# EAGLE design Central Hub (EAGLE 9.3.0)
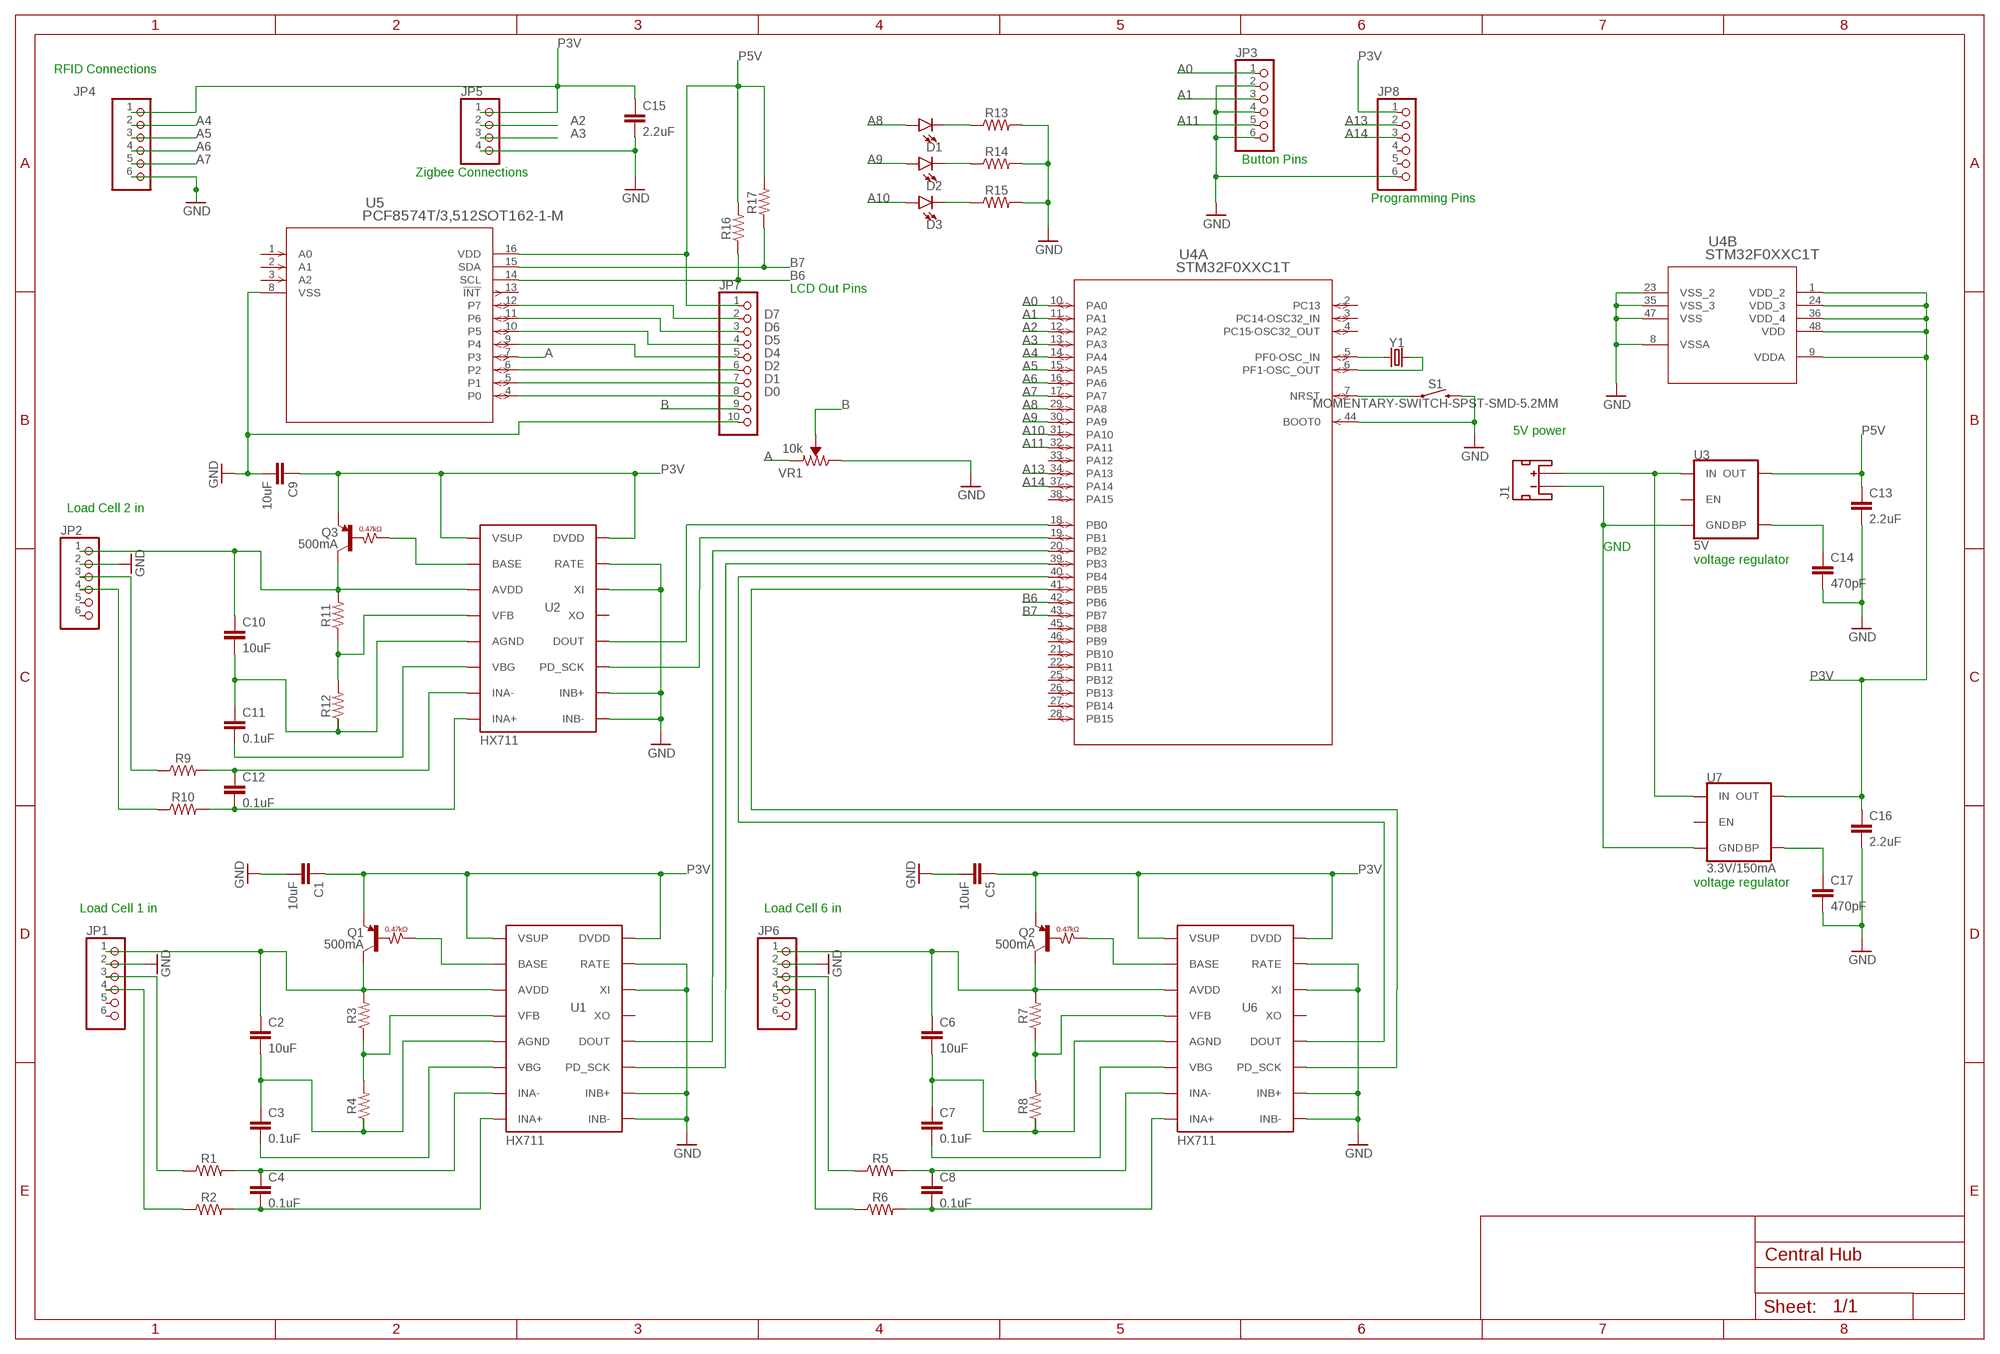
[diagram p0: schematic, sheet 1]

## Parts
C1  10uF  10UF-0603-6.3V-20%  [0603]
C2  10uF  10UF-0603-6.3V-20%  [0603]
C3  0.1uF  0.1UF-0603-25V-(+80/-20%)  [0603]
C4  0.1uF  0.1UF-0603-25V-(+80/-20%)  [0603]
C5  10uF  10UF-0603-6.3V-20%  [0603]
C6  10uF  10UF-0603-6.3V-20%  [0603]
C7  0.1uF  0.1UF-0603-25V-(+80/-20%)  [0603]
C8  0.1uF  0.1UF-0603-25V-(+80/-20%)  [0603]
C9  10uF  10UF-0603-6.3V-20%  [0603]
C10  10uF  10UF-0603-6.3V-20%  [0603]
C11  0.1uF  0.1UF-0603-25V-(+80/-20%)  [0603]
C12  0.1uF  0.1UF-0603-25V-(+80/-20%)  [0603]
C13  2.2uF  2.2UF-0603-10V-20%  [0603]
C14  470pF  470PF-0603-50V-5%  [0603]
C15  2.2uF  2.2UF-0603-10V-20%  [0603]
C16  2.2uF  2.2UF-0603-10V-20%  [0603]
C17  470pF  470PF-0603-50V-5%  [0603]
D1  LED5MM  [LED_5MM]
D2  LED5MM  [LED_5MM]
D3  LED5MM  [LED_5MM]
J1  JST_2MM_MALE  [JST-2-SMD]
JP1  PINHD-1X6  [1X06]
JP2  PINHD-1X6  [1X06]
JP3  PINHD-1X6  [1X06]
JP4  PINHD-1X6  [1X06]
JP5  PINHD-1X4  [1X04]
JP6  PINHD-1X6  [1X06]
JP7  PINHD-1X10  [1X10]
JP8  PINHD-1X6  [1X06]
Q1  500mA  TRANS_PNP_RES-DDTB142TC  [SOT23-3]
Q2  500mA  TRANS_PNP_RES-DDTB142TC  [SOT23-3]
Q3  500mA  TRANS_PNP_RES-DDTB142TC  [SOT23-3]
R1  RESISTOR0603  [0603]
R2  RESISTOR0603  [0603]
R3  RESISTOR0603  [0603]
R4  RESISTOR0603  [0603]
R5  RESISTOR0603  [0603]
R6  RESISTOR0603  [0603]
R7  RESISTOR0603  [0603]
R8  RESISTOR0603  [0603]
R9  RESISTOR0603  [0603]
R10  RESISTOR0603  [0603]
R11  RESISTOR0603  [0603]
R12  RESISTOR0603  [0603]
R13  RESISTOR0603  [0603]
R14  RESISTOR0603  [0603]
R15  RESISTOR0603  [0603]
R16  RESISTOR0603  [0603]
R17  RESISTOR0603  [0603]
S1  MOMENTARY-SWITCH-SPST-SMD-5.2MM  [TACTILE_SWITCH_SMD_5.2MM]
U1  HX711  [SO16]
U2  HX711  [SO16]
U3  5V  V_REG_MIC52055V  [SOT23-5]
U4  STM32F0XXC1T  [LQFP48-7X7MM]
U5  PCF8574T/3,512SOT162-1-M  [SOT162-1-M]
U6  HX711  [SO16]
U7  3.3V/150mA  V_REG_MIC52053.3V  [SOT23-5]
VR1  10k  TRIMPOT-PTH-10MM-KNOB-1/2W-10%  [TRIMPOT-PTH-3386U]
Y1  CRYSTALPTH-HC49US  [HC49US]

## Nets
A: U5.7(P3) VR1.1(CCW)
A0: JP3.1 U4.10(A:PA0)
A1: JP3.3 U4.11(A:PA1)
A2: JP5.2 U4.12(A:PA2)
A3: JP5.3 U4.13(A:PA3)
A4: JP4.2 U4.14(A:PA4)
A5: JP4.3 U4.15(A:PA5)
A6: JP4.4 U4.16(A:PA6)
A7: JP4.5 U4.17(A:PA7)
A8: D1.A U4.29(A:PA8)
A9: D2.A U4.30(A:PA9)
A10: D3.A U4.31(A:PA10)
A11: JP3.5 U4.32(A:PA11)
A13: JP8.2 U4.34(A:PA13)
A14: JP8.3 U4.37(A:PA14)
B: JP7.9 VR1.2(WIPER)
B6: R16.1 U4.42(A:PB6) U5.14(SCL)
B7: R17.1 U4.43(A:PB7) U5.15(SDA)
D0: JP7.8 U5.4(P0)
D1: JP7.7 U5.5(P1)
D2: JP7.6 U5.6(P2)
D4: JP7.5 U5.9(P4)
D5: JP7.4 U5.10(P5)
D6: JP7.3 U5.11(P6)
D7: JP7.2 U5.12(P7)
GND: C1.2 C5.2 C9.2 C13.2 C14.2 C15.2 C16.2 C17.2 JP1.2 JP2.2 JP3.2 JP3.4 JP3.6 JP4.6 JP5.4 JP6.2 JP7.10 JP8.6 R13.2 R14.2 R15.2 S1.3 U1.9(INB-) U1.10(INB+) U1.14(XI) U1.15(RATE) U2.9(INB-) U2.10(INB+) U2.14(XI) U2.15(RATE) U4.8(B:VSSA) U4.23(B:VSS_2) U4.35(B:VSS_3) U4.44(A:BOOT0) U4.47(B:VSS) U5.8(VSS) U6.9(INB-) U6.10(INB+) U6.14(XI) U6.15(RATE) VR1.3(CW)
N$2: JP1.3 R1.1
N$3: JP1.4 R2.1
N$4: C4.1 R1.2 U1.7(INA-)
N$5: C4.2 R2.2 U1.8(INA+)
N$6: Q1.1(B) U1.2(BASE)
N$7: C2.1 JP1.1 Q1.3(C) R3.2 U1.3(AVDD)
N$8: C2.2 C3.1 R4.1 U1.5(AGND)
N$9: R3.1 R4.2 U1.4(VFB)
N$10: S1.1 U4.7(A:NRST)
N$11: C3.2 U1.6(VBG)
N$12: JP6.3 R5.1
N$13: JP6.4 R6.1
N$14: C8.1 R5.2 U6.7(INA-)
N$15: C8.2 R6.2 U6.8(INA+)
N$16: Q2.1(B) U6.2(BASE)
N$17: C6.1 JP6.1 Q2.3(C) R7.2 U6.3(AVDD)
N$18: C6.2 C7.1 R8.1 U6.5(AGND)
N$19: R7.1 R8.2 U6.4(VFB)
N$20: C7.2 U6.6(VBG)
N$21: U4.5(A:PF0-OSC_IN) Y1.1
N$22: U4.6(A:PF1-OSC_OUT) Y1.2
N$23: JP2.3 R9.1
N$24: JP2.4 R10.1
N$25: C12.1 R9.2 U2.7(INA-)
N$26: C12.2 R10.2 U2.8(INA+)
N$27: Q3.1(B) U2.2(BASE)
N$28: C10.1 JP2.1 Q3.3(C) R11.2 U2.3(AVDD)
N$29: C10.2 C11.1 R12.1 U2.5(AGND)
N$30: R11.1 R12.2 U2.4(VFB)
N$31: C11.2 U2.6(VBG)
N$32: J1.1(-) U3.2(GND) U7.2(GND)
N$34: C17.1 U7.4(BP)
N$37: C14.1 U3.4(BP)
N$38: J1.2(+) U3.1(IN) U7.1(IN)
N$39: D1.K(C) R13.1
N$41: D2.K(C) R14.1
N$42: D3.K(C) R15.1
N$54: U4.41(A:PB5) U6.11(PD_SCK)
N$55: U4.40(A:PB4) U6.12(DOUT)
N$56: U1.11(PD_SCK) U4.39(A:PB3)
N$57: U1.12(DOUT) U4.20(A:PB2)
N$58: U2.11(PD_SCK) U4.19(A:PB1)
N$59: U2.12(DOUT) U4.18(A:PB0)
P3V: C1.1 C5.1 C9.1 C15.1 C16.1 JP4.1 JP5.1 JP8.1 Q1.2(E) Q2.2(E) Q3.2(E) U1.1(VSUP) U1.16(DVDD) U2.1(VSUP) U2.16(DVDD) U4.1(B:VDD_2) U4.9(B:VDDA) U4.24(B:VDD_3) U4.36(B:VDD_4) U4.48(B:VDD) U6.1(VSUP) U6.16(DVDD) U7.5(OUT)
P5V: C13.1 JP7.1 R16.2 R17.2 U3.5(OUT) U5.16(VDD)
Unconnected: J1.NC1(PAD1) J1.NC2(PAD2) JP1.5 JP1.6 JP2.5 JP2.6 JP6.5 JP6.6 JP8.4 JP8.5 U1.13(XO) U2.13(XO) U3.3(EN) U4.2(A:PC13) U4.3(A:PC14-OSC32_IN) U4.4(A:PC15-OSC32_OUT) U4.21(A:PB10) U4.22(A:PB11) U4.25(A:PB12) U4.26(A:PB13) U4.27(A:PB14) U4.28(A:PB15) U4.33(A:PA12) U4.38(A:PA15) U4.45(A:PB8) U4.46(A:PB9) U5.1(A0) U5.2(A1) U5.3(A2) U5.13(!INT) U6.13(XO) U7.3(EN)

## Notes on the sheet
- RFID Connections
- Button Pins
- Zigbee Connections
- Programming Pins
- LCD Out Pins
- 5V power
- Load Cell 2 in
- GND
- voltage regulator
- voltage regulator
- Load Cell 1 in | Load Cell 6 in

## Library data of the parts
C1 C2 C5 C6 C9 C10 = SparkFun-Capacitors:10UF: 10.0µF ceramic capacitors A capacitor is a passive two-terminal electrical component used to store electrical energy temporarily in an electric field.; PROD_ID: CAP-11015
C3 C4 C7 C8 C11 C12 = SparkFun-Capacitors:0.1UF: 0.1µF ceramic capacitors A capacitor is a passive two-terminal electrical component used to store electrical energy temporarily in an electric field.; PROD_ID: CAP-00810
C13 C15 C16 = SparkFun-Capacitors:2.2UF: 2.2µF ceramic capacitors A capacitor is a passive two-terminal electrical component used to store electrical energy temporarily in an electric field.; PROD_ID: CAP-07888
C14 C17 = SparkFun-Capacitors:470PF: 470pF ceramic capacitors A capacitor is a passive two-terminal electrical component used to store electrical energy temporarily in an electric field.; PROD_ID: CAP-07884
D1-D3 = SparkFun-LED:LED: LED (Generic) Standard schematic elements and footprints for 5mm, 3mm, 1206, and 0603 sized LEDs. Generic LEDs with no color specified.
J1 = SparkFun-Connectors:JST_2MM_MALE: JST 2MM MALE RA CONNECTOR Two pin, compact surface mount connector. Commonly used as a battery input connection point. We really like the solid locking feeling and high current rating on these small connectors. We use these all the time as battery connectors. Mates to single-cell LiPo batteries. Here is the connector we sell at SparkFun: JST Right Angle Connector - White <https://www.sparkfun.com/products/8612> (PRT-08612) Datasheet <http://www.sparkfun.com/datasheets/Prototyping/Connectors/JST-Horizontal.pdf> It was used on these SparkFun products: SparkFun MOSFET Power Controller <https://www.sparkfun.com/products/11214> (PRT-11214) SparkFun Battery Babysitter - LiPo Battery Manager <https://www.sparkfun.com/products/13777> (PRT-13777) And many, many others that required a lipo battery connection.; PROD_ID: CONN-11443; SF_ID: PRT-08612
JP1-JP4 JP6 JP8 = pinhead:PINHD-1X6: PIN HEADER
JP5 = pinhead:PINHD-1X4: PIN HEADER
JP7 = pinhead:PINHD-1X10: PIN HEADER
Q1-Q3 = SparkFun-DiscreteSemi:TRANS_PNP_RES: PNP transistor with built in base resistor Current controlled device with built in current control for tighter layouts. Link to datasheet <http://www.diodes.com/_files/datasheets/ds30403.pdf>. SparkFun Products: SparkFun OpenSegment Serial Display - White <https://www.sparkfun.com/products/11644> SparkFun OpenSegment Serial Display - Red <https://www.sparkfun.com/products/11644>; PROD_ID: TRANS-11479
R1-R17 = SparkFun-Resistors:RESISTOR: Generic Resistor Package
S1 = SparkFun-Switches:MOMENTARY-SWITCH-SPST: Momentary Switch (Pushbutton) - SPST Normally-open (NO) SPST momentary switches (buttons, pushbuttons). Variants PTH-12MM - 12mm square, through-hole Momentary Pushbutton Switch - 12mm Square <https://www.sparkfun.com/products/9190> (COM-09190) PTH-6.0MM, PTH-6.0MM-KIT - 6.0mm square, through-hole Mini Pushbutton Switch <https://www.sparkfun.com/products/97> (COM-00097) KIT package intended for soldering kit's - only one side of pads' copper is exposed. PTH-RIGHT-ANGLE-KIT - Right-angle, through-hole Right Angle Tactile Button <https://www.sparkfun.com/products/10791> - Used on SparkFun BigTime Watch Kit <https://www.sparkfun.com/products/11734> SMD-12MM - 12mm square, surface-mount Tactile Button - SMD (12mm) <https://www.sparkfun.com/products/12993> (COM-12993) Used on SparkFun PicoBoard <https://www.sparkfun.com/products/11888> SMD-4.5MM - 4.5mm Square Trackball Switch Used on SparkFun Blackberry Trackballer Breakout <https://www.sparkfun.com/products/13169> SMD-4.6MMX2.8MM - 4.60mm x 2.80mm, surface mount Used on SparkFun SAMD21 Mini Breakout <https://www.sparkfun.com/products/13664> SMD-5.2MM, SMD-5.2-REDUNDANT - 5.2mm square, surface-mount Mini Pushbutton Switch - SMD <https://www.sparkfun.com/products/8720> (COM-08720) Used on Arduino Pro Mini <https://www.sparkfun.com/products/11114> REDUNDANT package connects both switch circuits together SMD-6.0X3.5MM - 6.0 x 3.5mm, surface mount Momentary Reset Switch SMD <https://www.sparkfun.com/products/8229> (COM-08229) SMD-6.2MM-TALL - 6.2mm square, surface mount Tactile Button - SMD (6mm) <https://www.sparkfun.com/products/12992> Used on SparkFun Digital Sandbox <https://www.sparkfun.com/products/12651> SMD-RIGHT-ANGLE - Right-angle, surface mount Used on SparkFun Block for Intel® Edison - Arduino <https://www.sparkfun.com/products/13036>; PROD_ID: SWCH-08247; SF_SKU: COM-08720
U1 U2 U6 = SparkFun-IC-Conversion:HX711: AVIA Semiconductor HX711 - ADC 24-Bit Analog-to-Digital Converter for Weigh Scales Datasheet <https://cdn.sparkfun.com/datasheets/Sensors/ForceFlex/hx711_english.pdf> SparkFun Products: SparkFun Load Cell Amplifier - HX711 <https://www.sparkfun.com/products/13879>; PROD_ID: IC-12445
U3 = SparkFun-IC-Power:V_REG_MIC5205: V_REG MIC5205 Standard 3.3V, 5V, and Adjustable 150mA LDO voltage regulator in SOT-23 layout. Micrel part MIC5205. BP (by-pass) pin is used to lower output noise with 470pF cap, may be left open. On the adjustable version BP is used to set output.; PROD_ID: VREG-00823
U4 = ECE477_Resources:STM32F0XXC1T; MANUFACTURER_PART_NUMBER: stm32f0xxc1t; VENDOR: STMicroelectronics
U5 = ECE477_Resources:PCF8574T/3,512; MANUFACTURER_PART_NUMBER: PCF8574T3512; VENDOR: NXP
U7 = SparkFun-IC-Power:V_REG_MIC5205: V_REG MIC5205 Standard 3.3V, 5V, and Adjustable 150mA LDO voltage regulator in SOT-23 layout. Micrel part MIC5205. BP (by-pass) pin is used to lower output noise with 470pF cap, may be left open. On the adjustable version BP is used to set output.; PROD_ID: VREG-00822
VR1 = SparkFun-Resistors:TRIMPOT: Trimming Potentiometer (Trimpot) Three-terminal potentiometers, with an adjustable wiper and two adjustable resistors. A pot can be used to create a configurable voltage divider, or as a variable resistor. "Trimpots" are a subset of potentiometers, usually intended for "set-and-forget" applications. They're often more delicate than standard potentiometers - rated for fewer turns. Variants PTH-KNOB - PTH Trimpot w/ finger-adjustable knob Trimpot 10K with Knob <https://www.sparkfun.com/products/9806> (COM-09806) Datasheet <http://www.sparkfun.com/datasheets/Components/General/TSR-3386.pdf> SMD-3MM-CLOSED-FRAME - SMD 3mm Square Closed-Frame Trimpot Used on e.g. EasyDriver - Stepper Motor Driver <https://www.sparkfun.com/products/12779> Datasheet <http://www.bitechnologies.com/pdfs/22.pdf> (22AR10KTR) SMD-5MM - SMD 5mm Square Closed-Frame Trimpot Used on e.g. IOIO-OTG - V2.2 <https://www.sparkfun.com/products/13613> Datasheet <http://www.vishay.com/docs/51008/ts53.pdf> (TS53YL502MR10) SMD-3MM-1/10W-25% - 3mm Square Open-Frame Trimpot Used on e.g. SparkFun Shapeoko <https://www.sparkfun.com/products/13899> Datasheet <http://www.bourns.com/docs/Product-Datasheets/TC33.pdf> (TC33X-2-103E); PROD_ID: RES-09730; SF_SKU: COM-09806
Y1 = SparkFun-Clocks:CRYSTAL: Crystals (Generic) These are passive quartz crystals, which can be used as a clock source for a microcontroller. Crystal's are two-terminal devices. They require external "load" capacitors to generate an oscillating signal.

## Board
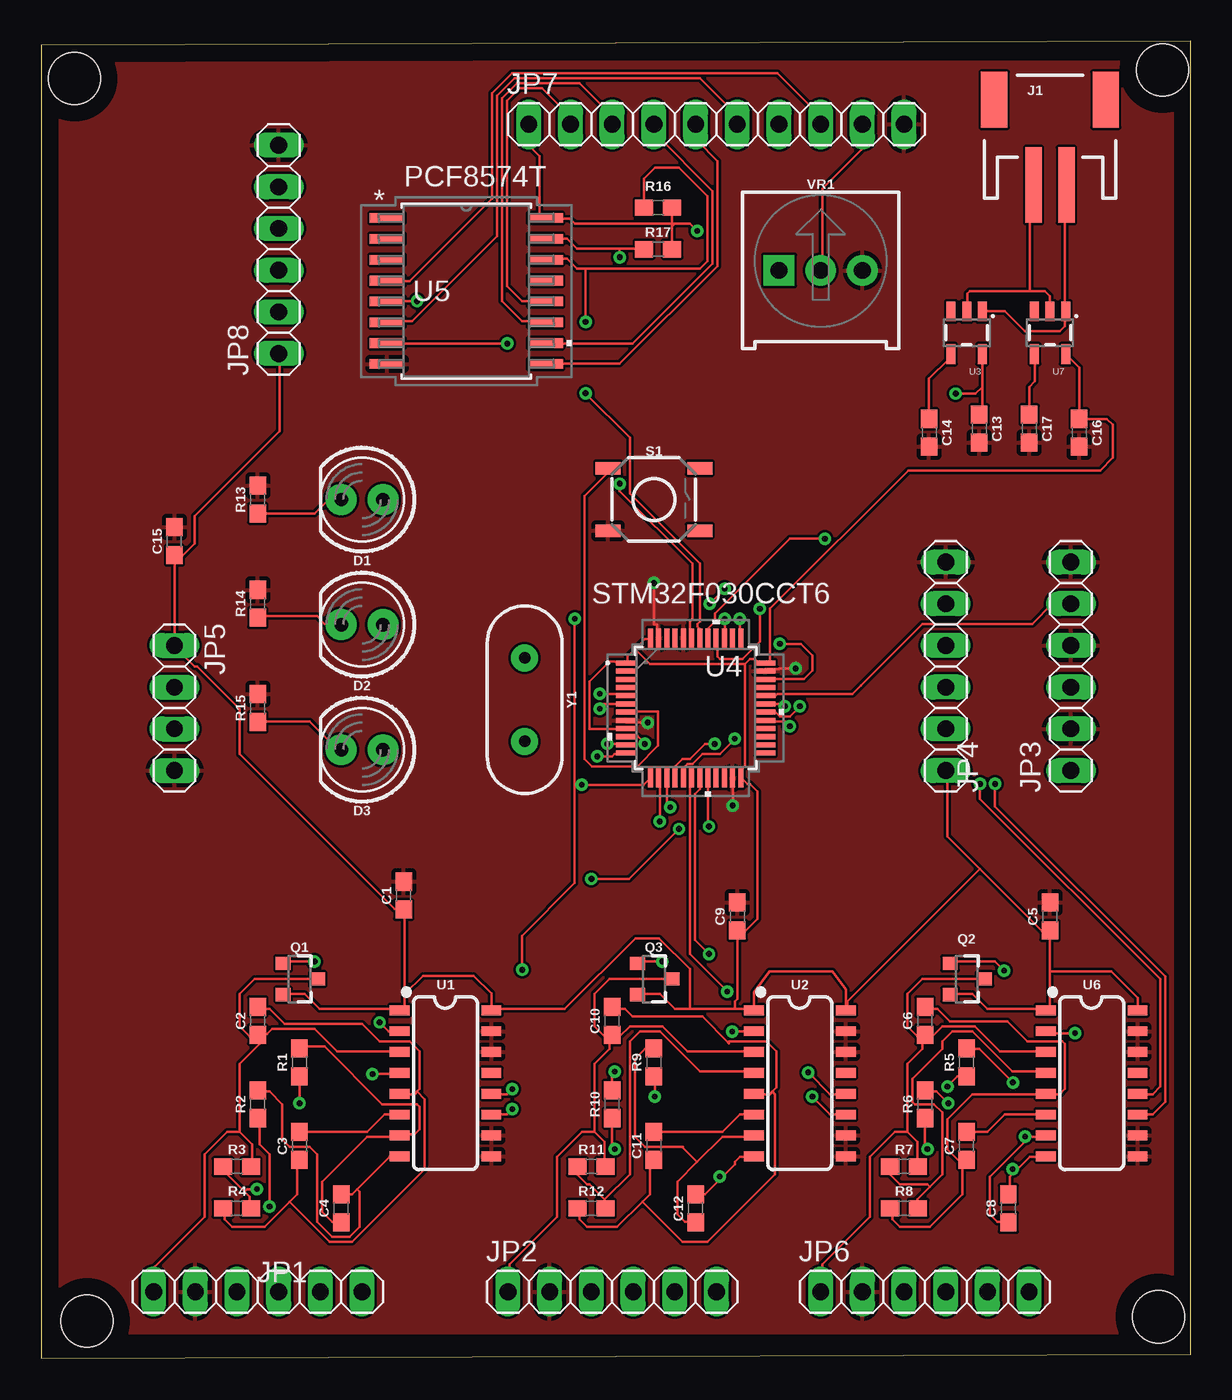
[diagram p1: board, top side]
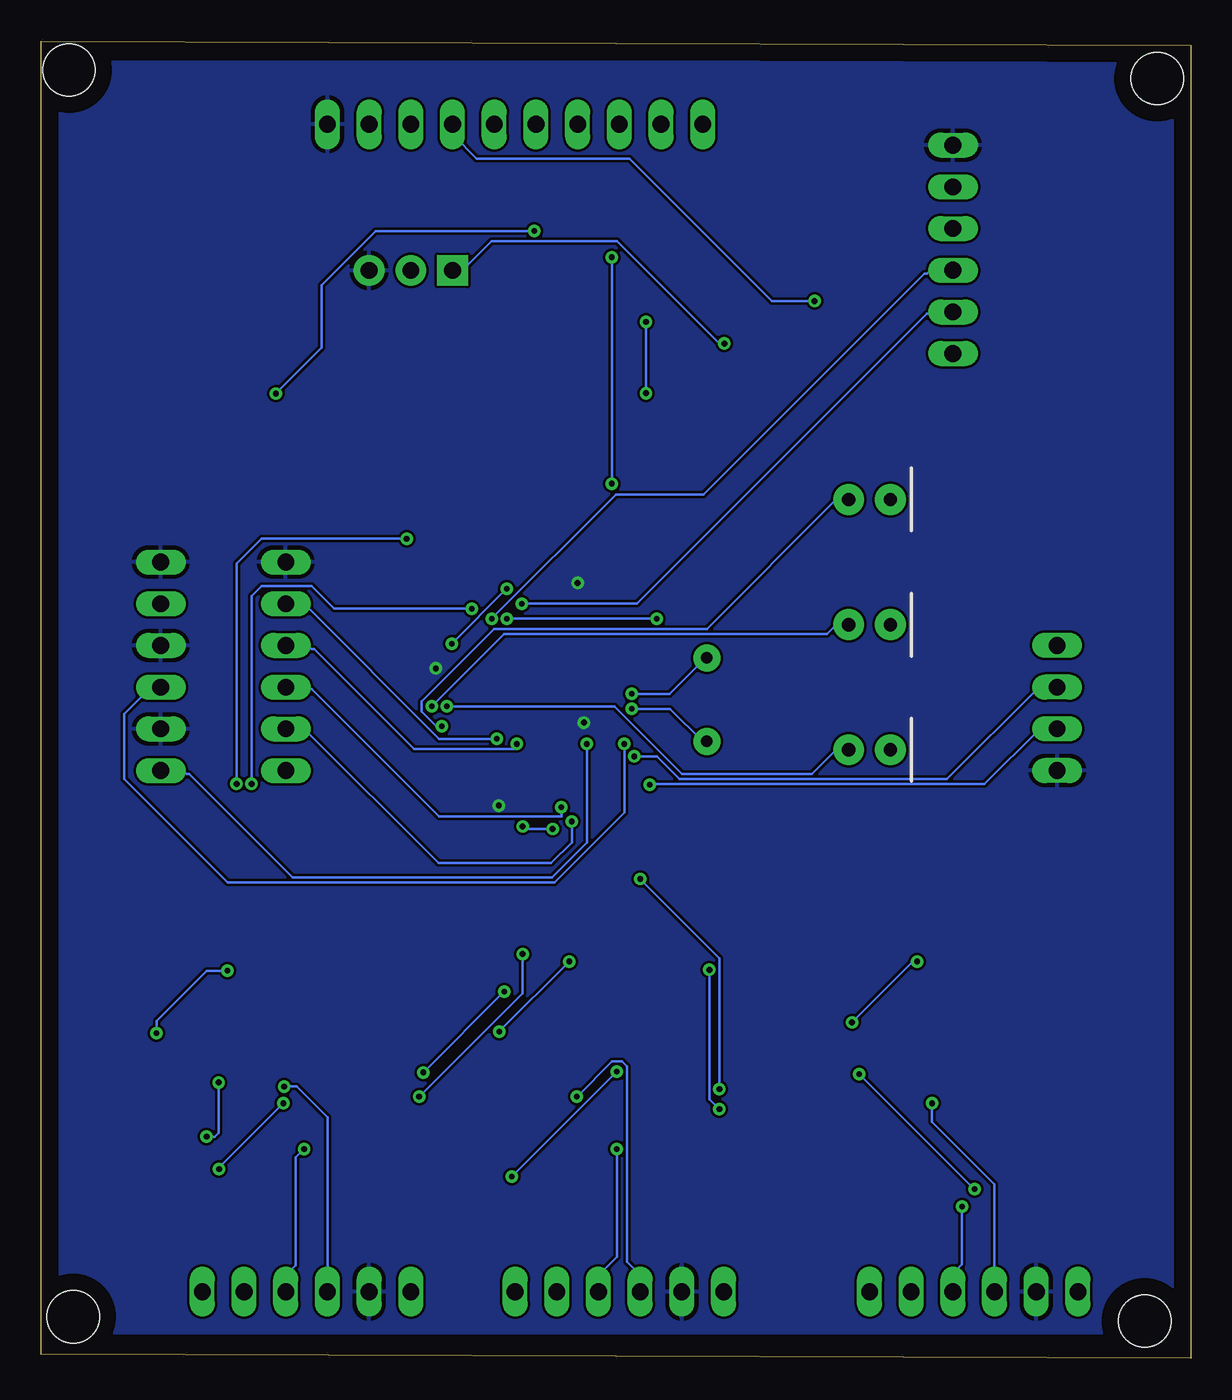
[diagram p2: board, bottom side, seen from below]

Size 70.03 x 80.25 mm. Coordinates in mm from the lower left corner, seen from the top.
Outline: 0,0 70.03,0.25 70.03,80.25 0,80 0,0
Copper layers (1*16): Top 0.035mm / dielectric 1.5mm / Bottom 0.035mm
Design rules "default": minimum track width 6mil, minimum drill 0.35mm, track to track 6mil, track to pad 6mil, pad to pad 6mil, via to via 6mil, smd to smd 6mil, copper to edge 40mil, drill to drill 6mil, minimum pad ring 10mil, minimum via ring 8mil, stop-mask expansion 4mil, vias tented up to drill 0mil, thermal gap 10mil
Holes 3.17 mm at 2.03,77.98 2.79,2.29 68.07,2.54 68.33,78.49

### Footprints (pad centres in the part's own frame; a part is rotated, then mirrored left to right if it is on the bottom)
0603 = smd 1.1 x 1: 1 -0.85,0; 2 0.85,0
LED_5MM = drill 0.813 pad 1.88: A -1.27,0; K 1.27,0
JST-2-SMD = smd 1 x 4.6: 1 -1,-3.7; 2 1,-3.7 | smd 1.6 x 3.4: NC1 -3.4,1.5; NC2 3.4,1.5
1X06 = drill 1.016 long: 1 -6.35,0; 2 -3.81,0; 3 -1.27,0; 4 1.27,0; 5 3.81,0; 6 6.35,0
1X04 = drill 1.016 long: 1 -3.81,0; 2 -1.27,0; 3 1.27,0; 4 3.81,0
1X10 = drill 1.016 long: 1 -11.43,0; 2 -8.89,0; 3 -6.35,0; 4 -3.81,0; 5 -1.27,0; 6 1.27,0; 7 3.81,0; 8 6.35,0; 9 8.89,0; 10 11.43,0
SOT23-3 = smd 0.8 x 0.9: 1 -0.95,-1; 2 0.95,-1; 3 0,1.1
TACTILE_SWITCH_SMD_5.2MM = smd 1.524 x 0.762: 1 -2.794,1.905; 2 2.794,1.905; 3 -2.794,-1.905; 4 2.794,-1.905
SO16 = smd 0.6 x 1.2: 1 -4.445,-2.8; 2 -3.175,-2.8; 3 -1.905,-2.8; 4 -0.635,-2.8; 5 0.635,-2.8; 6 1.905,-2.8; 7 3.175,-2.8; 8 4.445,-2.8; 9 4.445,2.8; 10 3.175,2.8; 11 1.905,2.8; 12 0.635,2.8; 13 -0.635,2.8; 14 -1.905,2.8; 15 -3.175,2.8; 16 -4.445,2.8
SOT23-5 = smd 0.55 x 1.2: 1 -0.95,-1.3; 2 0,-1.3; 3 0.95,-1.3; 4 0.95,1.3; 5 -0.95,1.3
LQFP48-7X7MM = smd 1.194 x 0.305: 1 -4.25,2.75; 2 -4.25,2.25; 3 -4.25,1.75; 4 -4.25,1.25; 5 -4.25,0.75; 6 -4.25,0.25; 7 -4.25,-0.25; 8 -4.25,-0.75; 9 -4.25,-1.25; 10 -4.25,-1.75; 11 -4.25,-2.25; 12 -4.25,-2.75; 25 4.25,-2.75; 26 4.25,-2.25; 27 4.25,-1.75; 28 4.25,-1.25; 29 4.25,-0.75; 30 4.25,-0.25; 31 4.25,0.25; 32 4.25,0.75; 33 4.25,1.25; 34 4.25,1.75; 35 4.25,2.25; 36 4.25,2.75 | smd 0.305 x 1.194: 13 -2.75,-4.25; 14 -2.25,-4.25; 15 -1.75,-4.25; 16 -1.25,-4.25; 17 -0.75,-4.25; 18 -0.25,-4.25; 19 0.25,-4.25; 20 0.75,-4.25; 21 1.25,-4.25; 22 1.75,-4.25; 23 2.25,-4.25; 24 2.75,-4.25; 37 2.75,4.25; 38 2.25,4.25; 39 1.75,4.25; 40 1.25,4.25; 41 0.75,4.25; 42 0.25,4.25; 43 -0.25,4.25; 44 -0.75,4.25; 45 -1.25,4.25; 46 -1.75,4.25; 47 -2.25,4.25; 48 -2.75,4.25
SOT162-1-M = smd 2.108 x 0.584: 1 -4.826,4.445; 2 -4.826,3.175; 3 -4.826,1.905; 4 -4.826,0.635; 5 -4.826,-0.635; 6 -4.826,-1.905; 7 -4.826,-3.175; 8 -4.826,-4.445; 9 4.826,-4.445; 10 4.826,-3.175; 11 4.826,-1.905; 12 4.826,-0.635; 13 4.826,0.635; 14 4.826,1.905; 15 4.826,3.175; 16 4.826,4.445
TRIMPOT-PTH-3386U = drill 1.016 pad 1.88 square: 1 -2.54,-0.015 | drill 1.016 pad 1.88: 2 0,-0.015; 3 2.54,-0.015
HC49US = drill 0.7 pad 1.651: 1 -2.54,0; 2 2.54,0

### Placement (x,y rotation side)
C1  22.1,28.19 90 top
C2  13.21,20.57 90 top
C3  15.75,12.95 90 top
C4  18.29,9.14 90 top
C5  61.47,26.92 90 top
C6  53.85,20.57 90 top
C7  56.39,12.95 90 top
C8  58.93,9.14 90 top
C9  42.42,26.92 90 top
C10  34.8,20.57 90 top
C11  37.34,12.95 90 top
C12  39.88,9.14 90 top
C13  57.15,56.64 270 top
C14  54.1,56.39 270 top
C15  8.13,49.78 90 top
C16  63.25,56.39 270 top
C17  60.2,56.64 270 top
D1  19.56,52.32 180 top
D2  19.56,44.7 180 top
D3  19.56,37.08 180 top
J1  61.47,75.18 0 top
JP1  13.21,4.06 0 top
JP2  34.8,4.06 0 top
JP3  62.74,42.16 90 top
JP4  55.12,42.16 90 top
JP5  8.13,39.62 270 top
JP6  53.85,4.06 0 top
JP7  41.15,75.18 0 top
JP8  14.48,67.56 90 top
Q1  15.75,23.11 270 top
Q2  56.39,23.11 270 top
Q3  37.34,23.11 270 top
R1  15.75,18.03 90 top
R2  13.21,15.49 90 top
R3  11.94,11.68 0 top
R4  11.94,9.14 0 top
R5  56.39,18.03 90 top
R6  53.85,15.49 90 top
R7  52.58,11.68 0 top
R8  52.58,9.14 0 top
R9  37.34,18.03 90 top
R10  34.8,15.49 90 top
R11  33.53,11.68 0 top
R12  33.53,9.14 0 top
R13  13.21,52.32 90 top
R14  13.21,45.97 90 top
R15  13.21,39.62 90 top
R16  37.59,70.1 0 top
R17  37.59,67.56 0 top
S1  37.34,52.32 0 top
U1  24.64,16.76 270 top
U2  46.23,16.76 270 top
U3  56.39,62.48 180 top
U4  39.88,39.62 0 top
U5  25.91,65.02 0 top
U6  64.01,16.76 270 top
U7  61.47,62.48 180 top
VR1  47.5,66.29 0 top
Y1  29.46,40.13 270 top

### Tracks (layer width: path | path; a pad name or v marks a point on that pad's centre or on a via)
A  (via drill 0.35)
  Top 0.152: v28.4,61.82 21.08,61.82 U5.7
  Bottom 0.152: v28.4,61.82 28.7,61.82 34.95,68.07 42.57,68.07 44.25,66.4 44.86,66.4 VR1.1
A0  (via drill 0.35)
  Top 0.152: v36.78,37.44 36.78,37.46 36.34,37.91 36.32,37.9 35.71,37.9 U4.10
  Bottom 0.152: v36.78,37.44 36.78,31.45 38.91,29.31 54.71,29.31 61.01,35.61 61.16,35.61 61.32,35.76 62.69,35.76 JP3.1
A1  (via drill 0.35)
  Top 0.152: v34.49,37.44 35.56,37.44 U4.11
  Bottom 0.152: v34.49,37.44 34.49,33.27 38.76,29.01 58.67,29.01 64.97,35.31 64.97,39.27 63.45,40.79 62.84,40.79 JP3.3
A2  (via drill 0.35)
  Top 0.152: v33.88,36.68 34.8,36.68 34.95,36.83 35.56,36.83 U4.12
  Bottom 0.152: v33.88,36.68 32.51,36.68 31.14,35.31 14.83,35.31 9.35,40.79 8.13,40.79 JP5.2
A3  (via drill 0.35)
  Top 0.152: U4.13 36.7,34.95 v32.94,34.95
  Bottom 0.152: v32.94,34.95 32.89,35 12.55,35 9.2,38.35 JP5.3
A4  (via drill 0.35)
  Top 0.152: U4.14 37.69,35.31 v37.69,32.71
  Bottom 0.152: v37.69,32.71 37.69,31.45 38.96,30.18 45.82,30.18 54,38.35 JP4.2
A5  (via drill 0.35)
  Top 0.152: U4.15 38.13,33.78 v38.33,33.58
  Bottom 0.152: v38.33,33.58 38.33,33.02 45.77,33.02 53.54,40.79 55.07,40.79 JP4.3
A6  (via drill 0.35)
  Top 0.152: v41.05,37.44 40.44,37.44 39.52,36.52 39.07,36.52 38.61,36.07 38.61,35.46 U4.16
  Bottom 0.152: v41.05,37.44 41.05,37.13 47.29,37.13 53.39,43.23 53.54,43.23 53.7,43.38 55.07,43.38 JP4.4
A7  (via drill 0.35)
  Top 0.152: v42.27,37.74 41.35,36.83 40.28,36.83 39.68,36.22 39.37,36.22 39.22,36.07 39.22,35.46 U4.17
  Bottom 0.152: v42.27,37.74 45.77,37.74 54,45.97 JP4.5
A8  (via drill 0.35)
  Top 0.152: v45.62,38.51 45.31,38.81 44.25,38.81 U4.29
  Bottom 0.152: v45.62,38.51 45.92,38.51 46.84,39.42 46.84,40.03 42.42,44.45 29.46,44.45 21.69,52.22 20.93,52.22 D1.A
A9  (via drill 0.35)
  Top 0.152: v46.23,39.73 45.62,39.12 45.01,39.12 44.7,39.42 44.25,39.42 U4.30
  Bottom 0.152: v46.23,39.73 41.81,44.14 22.15,44.14 21.69,44.6 20.93,44.6 D2.A
A10  (via drill 0.35)
  Top 0.152: 44.25,39.88 U4.31 45.16,39.87 v45.31,39.73
  Bottom 0.152: v45.31,39.73 35.1,39.73 30.99,35.61 23.06,35.61 21.69,36.98 20.93,36.98 D3.A
A11
  Top 0.152: JP3.5 61.62,45.97 60.4,44.75 53.7,44.75 49.94,41 49.43,40.49 44.86,40.49 44.7,40.34 44.25,40.34 U4.32
A13  (via drill 0.35)
  Top 0.152: v45.01,43.54 46.28,43.54 46.99,42.82 46.99,41.91 46.48,41.4 44.16,41.4 U4.34 44.25,41.4 | v40.74,45.97 v41.66,46.89
  Bottom 0.152: v41.66,46.89 v45.01,43.54 | v40.74,45.97 33.73,45.97 16.05,63.65 14.53,63.65 JP8.2
A14  (via drill 0.35)
  Top 0.152: v42.57,45.06 42.57,43.99 U4.37
  Bottom 0.152: v42.57,45.06 35,52.63 29.67,52.63 16.2,66.09 16.05,66.09 15.9,66.24 14.53,66.24 JP8.3
B
  Top 0.152: JP7.9 50.04,73.71 47.6,71.27 47.6,66.4 VR1.2
B6  (via drill 0.35)
  Top 0.152: 33.17,66.4 32.66,66.4 32.05,67.01 30.84,67.01 U5.14 | 33.17,66.4 40.13,66.4 40.59,66.85 40.59,70.82 38.86,72.54 37.4,72.54 36.74,71.88 R16.1 | 33.17,66.4 v33.17,63.14 | v33.17,58.8 33.17,58.78 35.87,56.08 35.87,52.68 40.13,48.41 40.13,44.91 39.98,44.75 39.98,44.6 40.13,44.45 40.13,43.99 U4.42
  Bottom 0.152: v33.17,63.14 v33.17,58.8
B7  (via drill 0.35)
  Top 0.152: 35.26,67.62 32.66,67.62 32.05,68.22 30.84,68.22 U5.15 | 35.26,67.62 36.68,67.62 R17.1 | v35.26,53.29 35.26,52.83 39.68,48.41 39.68,45.06 39.52,44.91 39.52,43.99 U4.43 | 35.26,67.62 v35.26,67.08
  Bottom 0.152: v35.26,67.08 v35.26,53.29
D0
  Top 0.152: U5.4 21.08,65.63 22.45,65.63 27.48,70.66 27.48,77.06 28.7,78.28 44.86,78.28 47.45,75.69 47.45,75.23 JP7.8
D1  (via drill 0.35)
  Top 0.152: v22.91,64.41 21.08,64.41 U5.5
  Bottom 0.152: v22.91,64.41 25.5,64.41 34.19,73.1 43.48,73.1 44.86,74.47 44.86,75.08 JP7.7
D2
  Top 0.152: JP7.6 42.42,75.69 40.13,77.98 28.85,77.98 27.79,76.91 27.79,68.38 22.61,63.2 21.08,63.2 U5.6
D4
  Top 0.152: U5.9 30.84,60.6 35.26,60.6 41.2,66.55 41.2,72.95 39.98,74.17 39.98,75.08 JP7.5
D5
  Top 0.152: U5.10 30.84,61.82 36.02,61.82 40.89,66.7 40.89,71.12 37.39,74.62 37.39,75.08 JP7.4
D6
  Top 0.152: JP7.3 34.8,75.69 32.82,77.67 29.01,77.67 28.09,76.76 28.09,64.41 29.31,63.2 30.68,63.2 U5.11
D7
  Top 0.152: U5.12 30.68,64.41 29.31,64.41 28.4,65.33 28.4,76.61 29.16,77.37 30.53,77.37 32.21,75.69 32.21,75.23 JP7.2
GND  (via drill 0.35)
  Top 0.152: U4.8 35.63,38.75 36.45,38.75 36.45,38.73 v36.96,38.73 | U4.47 37.51,43.87 37.51,44.7 37.34,44.7 v37.34,47.24 | v45.97,42.04 44.95,42.04 44.95,41.99 44.13,41.99 U4.35 | U4.23 arc-90 42.14,35.36 v42.14,33.68
  pour Top: 1.02,1.52 1.02,78.99 69.09,78.99 69.09,1.52
  pour Bottom: 1.02,1.52 1.02,78.99 69.09,78.99 69.09,1.52
N$2  (via drill 0.35)
  Top 0.152: v15.75,15.54 R1.1
  Bottom 0.152: v15.75,15.54 15.75,14.43 11.94,10.62 JP1.3
N$3  (via drill 0.35)
  Top 0.152: v13.92,9.25 13.92,12.45 13.31,13.06 13.31,14.58 R2.1
  Bottom 0.152: v13.92,9.25 13.92,5.74 14.38,5.28 14.38,4.06 JP1.4
N$4
  Top 0.152: C4.1 18.19,8.33 17.73,8.33 17.12,8.94 17.12,10.77 19.86,13.51 21.69,13.51 U1.7 21.84,13.66 22.76,13.66 23.06,13.97 23.06,15.34 22.91,15.49 22.45,15.49 22.1,15.49 20.78,15.49 17.27,19 15.75,19 R1.2
N$5
  Top 0.152: 19.25,10.31 18.95,10.01 18.34,10.01 C4.2 | 19.25,10.31 21.23,12.29 21.69,12.29 U1.8 | 19.25,10.31 19.41,10.16 19.41,8.03 18.8,7.42 17.73,7.42 16.81,8.33 16.81,12.45 16.36,12.9 15.14,12.9 14.68,13.36 14.68,15.49 13.92,16.26 13.31,16.26 R2.2
N$6  (via drill 0.35)
  Top 0.152: v16.66,24.18 14.83,24.18 Q1.1 | v20.62,20.47 21.18,19.91 21.69,19.91 U1.2
  Bottom 0.152: v20.62,20.47 16.92,24.18 v16.66,24.18
N$7
  Top 0.152: Q1.3 13,23.11 12.09,22.2 12.09,20.22 12.7,19.61 13.16,19.61 C2.1 | 12.09,13.82 12.85,13.06 12.85,11.68 R3.2 | 12.09,13.82 12.09,17.93 13.31,19.15 13.31,19.61 C2.1 | U1.3 21.69,18.69 18.03,18.69 16.66,20.07 14.07,20.07 13.77,19.76 13.31,19.76 C2.1 | 12.09,13.82 11.33,13.82 9.96,12.45 9.96,8.64 6.91,5.59 6.91,4.06 JP1.1
N$8
  Top 0.152: 15.14,9.55 15.6,10.01 15.6,11.84 15.75,11.99 C3.1 | 15.14,9.55 13.61,8.03 11.63,8.03 11.18,8.48 11.18,9.09 R4.1 | 22.91,16.26 22.76,16.1 21.84,16.1 U1.5 | 22.91,16.26 23.06,16.41 23.06,18.69 22.45,19.3 20.62,19.3 19.56,20.37 14.83,20.37 13.92,21.29 13.31,21.29 C2.2 | 15.14,9.55 17.58,7.11 18.95,7.11 23.37,11.53 23.37,15.8 22.91,16.26
N$9  (via drill 0.35)
  Top 0.152: 12.39,10.16 11.15,11.4 11.15,11.62 R3.1 | 12.39,10.16 12.7,9.86 12.7,9.25 R4.2 | v20.19,17.32 21.69,17.32 U1.4 | v13.16,10.31 12.55,10.31 12.39,10.16
  Bottom 0.152: v20.19,17.32 20.19,17.35 v13.16,10.31
N$10
  Top 0.152: U4.7 35.71,39.42 37.59,39.42 37.59,37.34 36.32,36.07 33.58,36.07 33.12,36.52 33.12,52.53 34.49,53.9 34.49,54.2 S1.1
N$11
  Top 0.152: C3.2 15.75,13.82 19.86,13.82 20.93,14.88 21.69,14.88 U1.6
N$12  (via drill 0.35)
  Top 0.152: v55.22,16.56 55.83,17.17 56.29,17.17 R5.1
  Bottom 0.152: v55.22,16.56 54.46,16.56 52.58,14.68 JP6.3
N$13  (via drill 0.35)
  Top 0.152: R6.1 53.85,12.9 v54,12.75
  Bottom 0.152: v54,12.75 54.51,12.24 54.51,5.69 55.07,5.13 55.07,4.06 JP6.4
N$14  (via drill 0.35)
  Top 0.152: 60.1,13.36 60.25,13.51 61.16,13.51 U6.7 | 60.1,13.36 57.81,11.07 57.81,8.79 58.27,8.33 58.88,8.33 C8.1 | v59.21,16.82 57.18,18.85 56.44,18.85 R5.2 | 60.1,13.36 v59.94,13.51
  Bottom 0.152: v59.21,16.82 59.21,13.74 59.44,13.51 v59.94,13.51
N$15  (via drill 0.35)
  Top 0.152: 59.33,11.38 60.25,12.29 61.16,12.29 U6.8 | 59.33,11.38 59.03,11.07 59.03,10.01 C8.2 | v55.27,15.54 54.56,16.26 53.85,16.26 R6.2 | 59.33,11.38 v59.18,11.53
  Bottom 0.152: v59.18,11.53 59.18,11.63 v55.27,15.54
N$16  (via drill 0.35)
  Top 0.152: Q2.1 55.52,24.18 58.12,24.18 v58.67,23.62 | 61.16,19.91 U6.2 61.34,19.81 v62.99,19.81
  Bottom 0.152: v62.99,19.81 62.99,20.57 59.94,23.62 v58.67,23.62
N$17
  Top 0.152: Q2.3 53.7,23.11 52.78,22.2 52.78,20.22 53.39,19.61 53.7,19.61 | 53.85,19.61 53.7,19.61 | 52.78,13.82 53.39,13.21 53.39,11.68 R7.2 | 52.78,13.82 52.78,17.93 53.7,18.85 53.7,19.61 | 53.7,19.61 C6.1 53.85,19.61 | 53.85,19.61 54.3,19.61 54.91,20.22 56.9,20.22 58.42,18.69 61.16,18.69 U6.3 | 52.78,13.82 52.02,13.82 50.49,12.29 50.49,8.64 47.6,5.74 47.6,4.06 JP6.1
N$18
  Top 0.152: C7.1 56.13,11.85 56.13,10.01 54.15,8.03 52.32,8.03 51.87,8.48 51.87,9.09 R8.1 | 56.13,11.84 56.29,11.99 C7.1 | C6.2 53.85,21.29 54.61,21.29 55.37,20.52 58.88,20.52 60.1,19.3 62.18,19.3 62.21,19.33 62.38,19.15 62.38,16.41 62.08,16.1 61.32,16.1 U6.5 61.16,16.1 56.74,16.1 55.22,14.58 55.22,12.75 56.13,11.84 | 56.13,11.84 C7.1
N$19
  Top 0.152: 54.15,10.46 54,10.62 52.32,10.62 51.71,11.23 51.71,11.68 R7.1 | R8.2 53.39,9.25 53.39,9.7 54.15,10.46 | 54.15,10.46 54.91,11.23 54.91,14.99 54.41,15.49 53.24,15.49 53.09,15.65 53.09,17.02 54.91,18.85 54.91,19.3 55.52,19.91 56.74,19.91 59.18,17.48 61.16,17.48 U6.4
N$20
  Top 0.152: C7.2 56.44,13.82 57.66,13.82 58.73,14.88 61.16,14.88 U6.6
N$21  (via drill 0.35)
  Top 0.152: v34.04,40.49 35.56,40.49 U4.5
  Bottom 0.152: v34.04,40.49 31.75,40.49 29.57,42.67 Y1.1
N$22  (via drill 0.35)
  Top 0.152: v34.04,39.57 34.04,39.65 34.26,39.88 35.56,39.88 U4.6
  Bottom 0.152: v34.04,39.57 31.7,39.57 29.72,37.59 Y1.2
N$23  (via drill 0.35)
  Top 0.152: v37.39,15.95 37.39,17.17 R9.1
  Bottom 0.152: v37.39,15.95 35.26,18.09 34.65,18.09 34.34,17.78 34.34,5.89 33.58,5.13 33.58,4.06 JP2.3
N$24  (via drill 0.35)
  Top 0.152: R10.1 34.8,12.9 v34.95,12.75
  Bottom 0.152: v34.95,12.75 34.95,6.2 36.02,5.13 36.02,4.06 JP2.4
N$25
  Top 0.152: 39.95,11.96 41.5,13.51 43.33,13.51 U2.7 | 39.95,11.96 38.76,10.77 38.76,8.79 39.22,8.33 39.83,8.33 C12.1 | 39.95,11.96 39.07,12.85 39.12,12.9 36.78,12.9 36.17,13.51 36.17,18.24 36.78,18.85 37.24,18.85 R9.2
N$26  (via drill 0.35)
  Top 0.152: 41.5,11.07 42.27,11.84 42.27,11.99 42.57,12.29 43.33,12.29 U2.8 | 41.5,11.07 40.44,10.01 39.98,10.01 C12.2 | R10.2 34.8,17.32 v34.95,17.48 | 41.5,11.07 v41.35,11.07
  Bottom 0.152: v41.35,11.07 v34.95,17.48
N$27  (via drill 0.35)
  Top 0.152: v37.85,24.18 36.47,24.18 Q3.1 | v42.11,19.91 43.33,19.91 U2.2
  Bottom 0.152: v42.11,19.91 v37.85,24.18
N$28
  Top 0.152: Q3.3 34.65,23.11 33.73,22.2 33.73,20.22 34.34,19.61 34.65,19.61 | 34.8,19.61 34.65,19.61 | 33.73,13.82 34.34,13.21 34.34,11.68 R11.2 | 33.73,13.82 33.73,17.93 34.65,18.85 34.65,19.61 | 34.65,19.61 C10.1 34.8,19.61 | 34.8,19.61 35.26,19.61 35.87,20.22 37.85,20.22 39.37,18.69 43.33,18.69 U2.3 | 33.73,13.82 32.97,13.82 31.45,12.29 31.45,8.64 28.55,5.74 28.55,4.06 JP2.1
N$29
  Top 0.152: 36.63,9.55 37.08,10.01 37.08,11.84 37.24,11.99 C11.1 | 36.63,9.55 35.1,8.03 33.27,8.03 32.82,8.48 32.82,9.09 R12.1 | 41.91,19.2 41.86,19.25 | 41.86,19.25 40.28,20.83 36.02,20.83 35.56,21.29 34.8,21.29 C10.2 | 44.55,16.26 44.4,16.1 43.48,16.1 U2.5 | 44.55,16.26 44.81,16.51 44.81,18.69 44.2,19.3 41.91,19.3 41.86,19.25 | 36.63,9.55 39.07,7.11 40.59,7.11 44.7,11.23 44.7,16.1 44.55,16.26
N$30
  Top 0.152: 34.34,9.7 34.34,9.25 R12.2 | 34.34,9.7 33.43,10.62 33.27,10.62 32.66,11.23 32.66,11.68 R11.1 | 34.34,9.7 35.87,11.23 35.87,19.3 36.47,19.91 37.69,19.91 40.13,17.48 43.33,17.48 U2.4
N$31
  Top 0.152: C11.2 37.39,13.82 41.5,13.82 42.57,14.88 43.33,14.88 U2.6
N$32
  Top 0.152: 60.25,65.02 61.16,65.02 61.47,64.72 U7.2 | 60.25,65.02 56.59,65.02 56.44,64.87 56.44,63.8 U3.2 | 60.25,65.02 60.25,71.27 60.4,71.43 J1.1
N$34
  Top 0.152: U7.4 60.55,61.06 60.55,60.45 60.55,60.3 60.55,59.54 60.2,59.18 C17.1
N$37
  Top 0.152: U3.4 55.37,61.06 55.3,61.14 55.3,60.88 54.1,59.69 C14.1
N$38
  Top 0.152: U3.1 57.35,63.8 58.73,63.8 59.94,62.59 62.08,62.59 62.38,62.89 62.38,63.65 U7.1 62.38,63.8 62.38,71.43 J1.2
N$39
  Top 0.152: R13.1 13.31,51.46 16.66,51.46 17.42,52.22 18.19,52.22 D1.K
N$41
  Top 0.152: R14.1 13.31,45.21 16.81,45.21 17.27,44.75 18.19,44.75 D2.K
N$42
  Top 0.152: R15.1 13.31,38.81 16.36,38.81 18.19,36.98 D3.K
N$54  (via drill 0.35)
  Top 0.152: v47.75,49.94 45.62,49.94 41.05,45.36 41.05,44.91 40.59,44.45 40.59,43.99 U4.41 | v58.12,35 58.12,33.63 68.48,23.27 68.48,15.65 67.72,14.88 66.95,14.88 U6.11
  Bottom 0.152: v47.75,49.94 56.59,49.94 58.12,48.41 v58.12,35
N$55  (via drill 0.35)
  Top 0.152: v43.79,45.67 43.79,43.69 42.72,42.62 41.35,42.62 41.2,42.77 41.2,43.84 U4.40 | v57.2,35 57.2,34.09 68.17,23.11 68.17,16.56 67.72,16.1 66.95,16.1 U6.12
  Bottom 0.152: v43.79,45.67 52.17,45.67 53.54,47.04 56.59,47.04 57.2,46.43 v57.2,35
N$56  (via drill 0.35)
  Top 0.152: v41.66,45.06 41.66,43.99 U4.39 | v32.51,45.06 32.51,28.96 29.31,25.76 v29.31,23.67 | v28.7,15.19 28.4,14.88 27.48,14.88 U1.11
  Bottom 0.152: v32.51,45.06 v41.66,45.06 | v29.31,23.67 29.31,15.8 v28.7,15.19
N$57  (via drill 0.35)
  Top 0.152: U4.20 40.62,35.36 40.62,32.49 v40.69,32.41 | v28.7,16.41 28.4,16.1 27.48,16.1 U1.12 | v38.86,32.26 35.81,29.21 v33.53,29.21
  Bottom 0.152: v40.69,32.41 40.54,32.26 v38.86,32.26 | v33.53,29.21 28.7,24.38 v28.7,16.41
N$58  (via drill 0.35)
  Top 0.152: v40.69,24.64 39.83,25.5 39.83,34.39 40.13,34.7 40.13,35.31 U4.19 | v46.99,15.95 48.06,14.88 48.97,14.88 U2.11
  Bottom 0.152: v40.69,24.64 40.69,22.25 v46.99,15.95
N$59  (via drill 0.35)
  Top 0.152: v41.81,22.35 39.52,24.64 39.52,35.31 U4.18 | v46.74,17.42 48.06,16.1 48.97,16.1 U2.12
  Bottom 0.152: v46.74,17.42 v41.81,22.35
P3V
  Top 0.152: U4.9 35.56,38.35 33.43,38.35 33.43,41.25 34.65,42.47 34.95,42.47 35.1,42.32 35.56,42.32 U4.1 35.71,42.47 35.71,42.77 36.17,43.23 | 36.17,43.23 36.78,43.84 37.08,43.84 U4.48 | 42.87,42.32 42.87,36.07 42.57,35.76 42.57,35.46 U4.24 42.72,35.31 43.03,35 43.18,35 43.64,34.54 43.64,26.77 42.87,26.01 42.42,26.01 | 42.87,42.32 43.18,42.62 43.48,42.62 43.79,42.32 44.09,42.32 U4.36 44.25,42.32 44.4,42.32 44.4,45.67 52.83,54.1 64.52,54.1 65.28,54.86 65.28,56.9 64.94,57.24 C16.1 | 36.17,43.23 37.08,42.32 42.87,42.32 | C16.1 63.41,57.4 | 8.13,48.87 JP5.1 8.13,43.38 9.35,42.16 9.5,42.16 12.09,39.57 12.09,36.83 21.54,27.38 22,27.38 C1.1 22.15,27.23 22.15,22.2 | 8.13,48.87 8.59,48.87 9.35,49.63 9.35,51.31 14.53,56.49 14.53,61.21 JP8.1 | 8.13,48.87 C15.1 | Q1.2 14.83,22.2 16.05,22.2 16.97,21.29 21.69,21.29 U1.1 | 22.15,22.2 22.15,21.44 22,21.29 | 22,21.29 21.84,21.13 U1.1 | 22.15,22.2 23.27,23.32 26.35,23.32 27.44,22.23 U1.16 27.48,21.29 31.9,21.29 36.22,25.6 37.64,25.6 39.52,23.72 39.52,21.29 | 22,21.29 U1.1 | 42.27,21.29 43.33,21.29 U2.1 43.43,22.31 44.37,23.57 48.22,23.57 49.03,22.49 U2.16 49.12,21.29 49.12,21.74 57.2,29.82 | 42.27,21.29 39.52,21.29 | 39.52,21.29 38.61,21.29 37.69,22.2 36.47,22.2 Q3.2 | 42.42,26.01 42.42,21.89 42.27,21.74 42.27,21.29 | Q2.2 55.52,22.2 56.74,22.2 57.66,21.29 61.16,21.29 U6.1 | 61.47,21.29 61.47,23.57 | 61.47,23.57 61.47,26.01 | 61.47,21.29 61.32,21.13 U6.1 | 61.47,23.57 65.21,23.57 66.81,21.97 U6.16 | 61.47,21.29 U6.1 | 57.2,29.82 61.01,26.01 61.47,26.01 | 57.2,29.82 55.22,31.8 55.22,35.76 JP4.1 | 61.47,26.01 C5.1 | 42.42,26.01 C9.1 | U7.5 63.25,60.36 C16.1
P5V  (via drill 0.35)
  Top 0.152: U3.5 57.34,59.18 | 57.34,59.18 57.34,57.68 C13.1 | 38.25,67.75 R17.2 38.44,68.95 | JP7.1 29.77,75.08 29.77,73.86 30.38,73.25 30.38,69.75 30.68,69.44 U5.16 30.84,69.44 32.21,69.44 32.54,69.11 38.61,69.11 | 38.61,69.11 39.55,69.11 v39.98,68.68 | 38.44,68.95 38.61,69.11 | R16.2 38.44,68.95 | v55.73,58.78 56.93,58.78 57.34,59.18
  Bottom 0.152: v55.73,58.78 52.93,61.57 52.93,65.38 49.63,68.68 v39.98,68.68